# EAGLE board FPGA_board-v1 (EAGLE 9.5.2), part 1 of 2
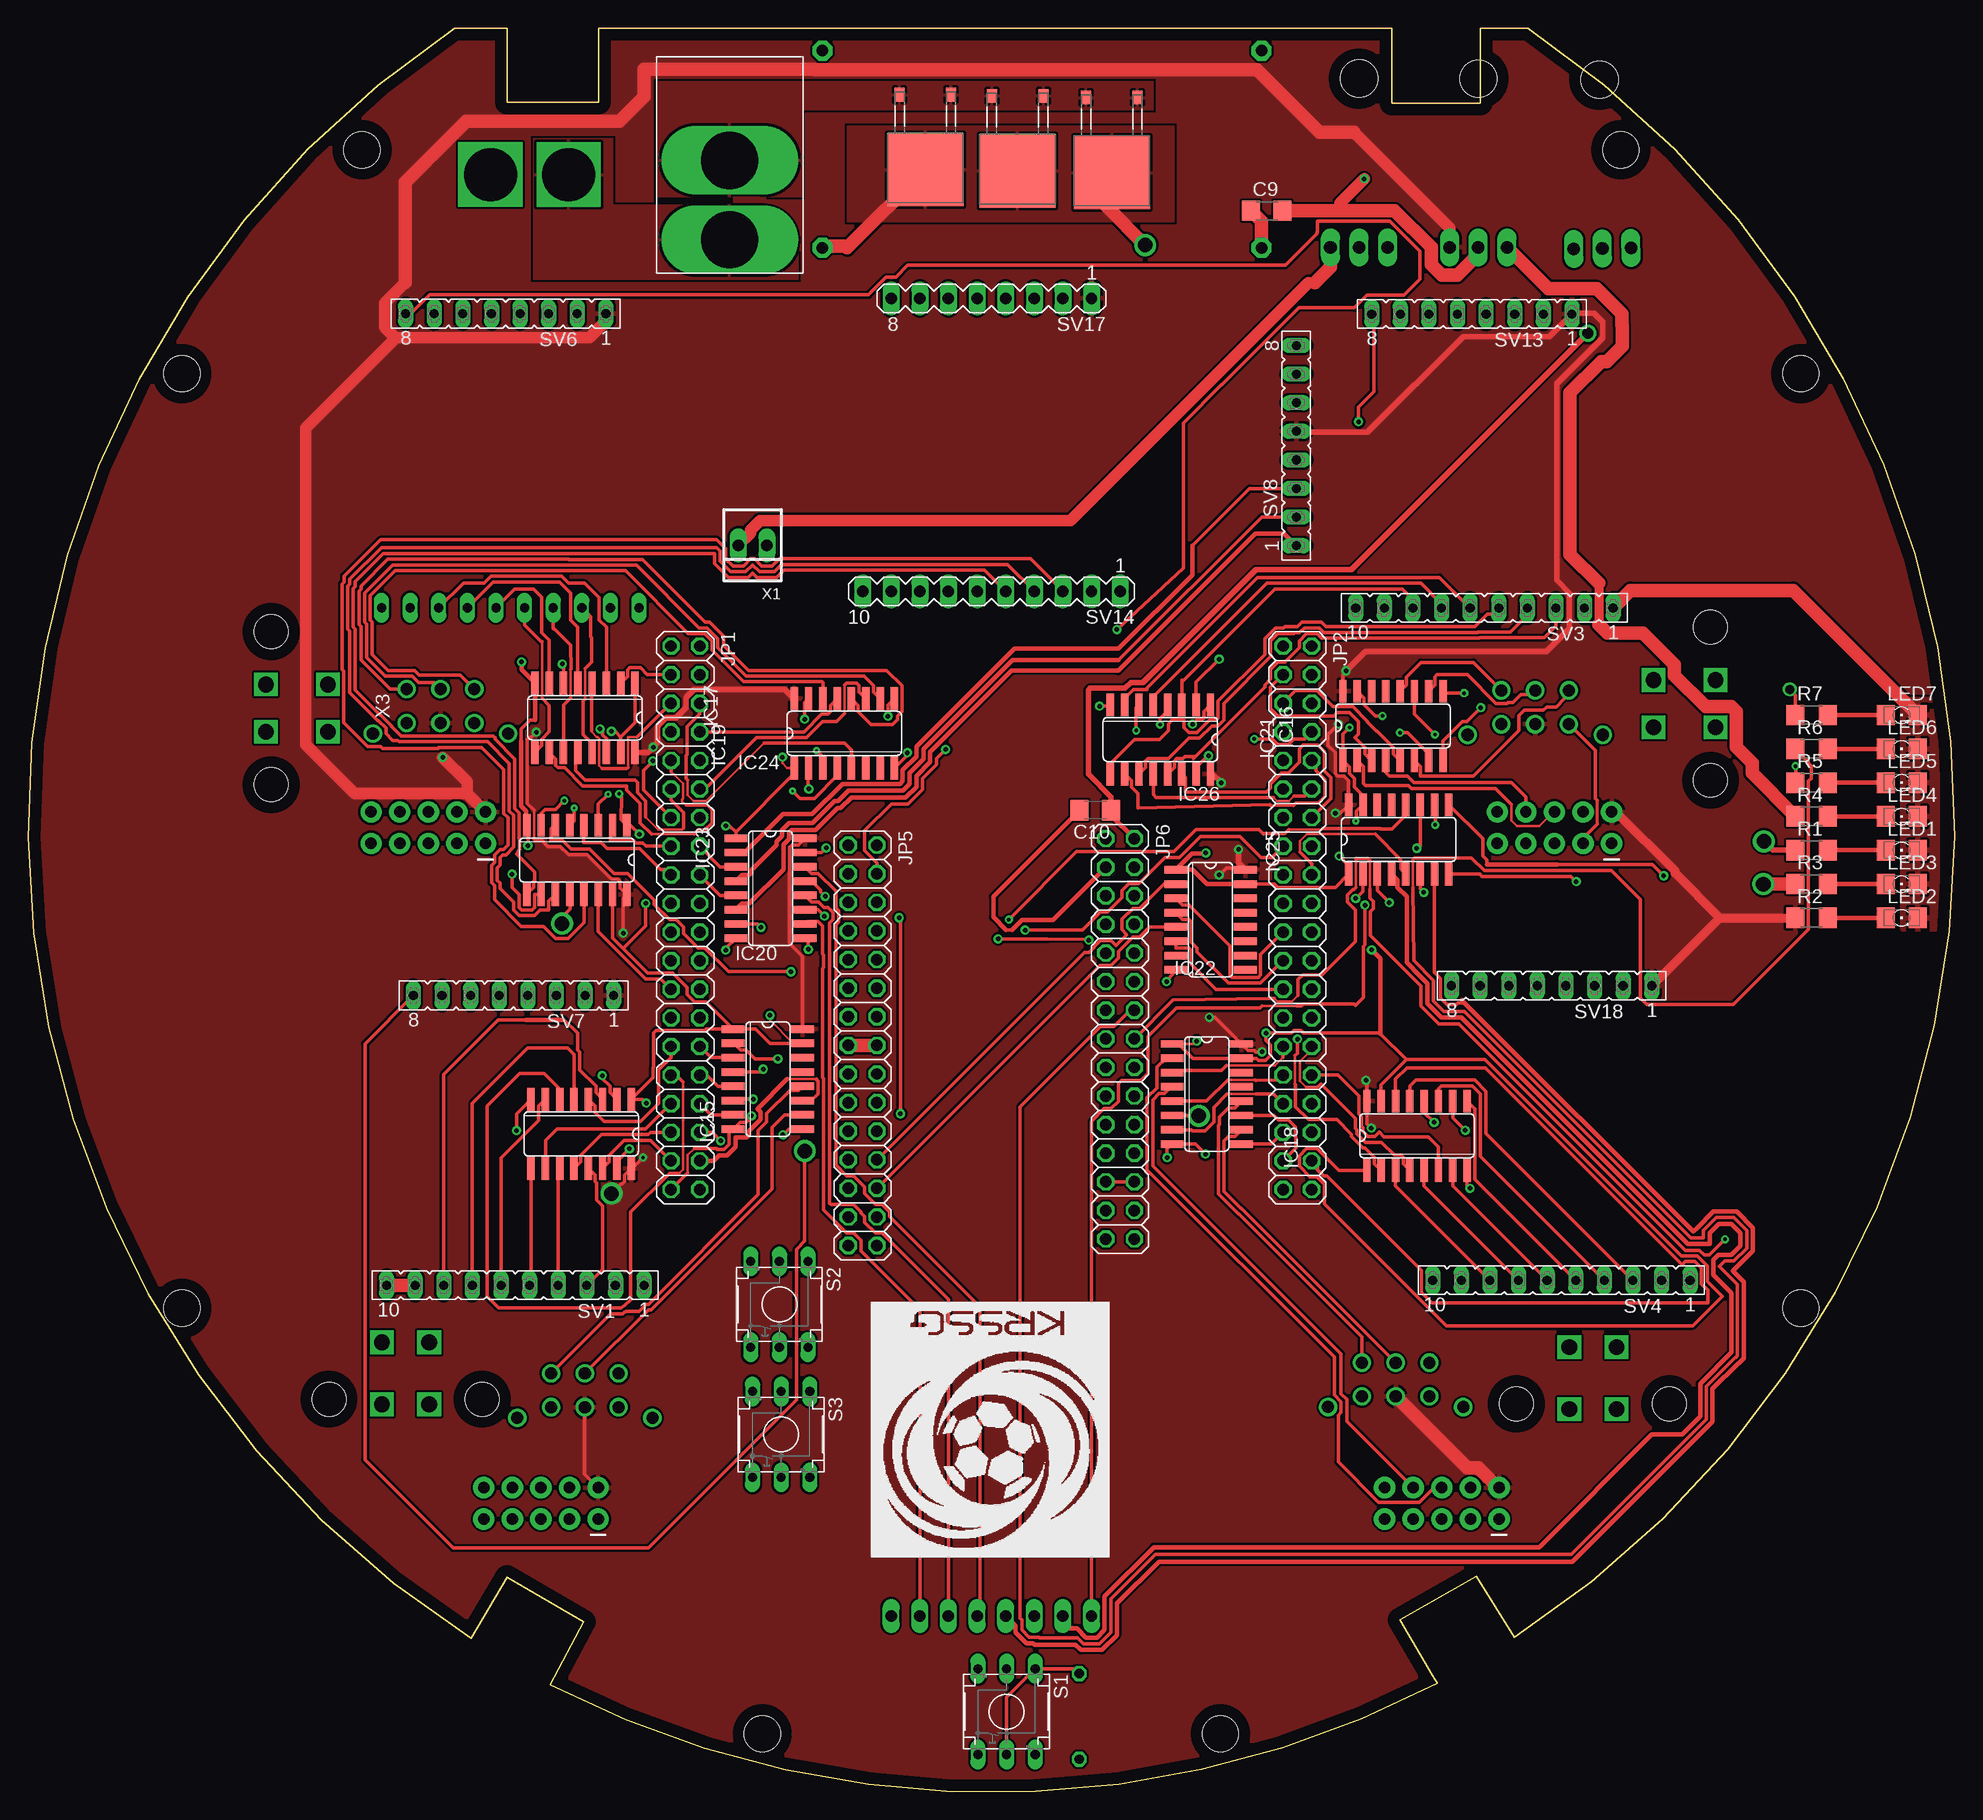
[diagram p1: board, top side]
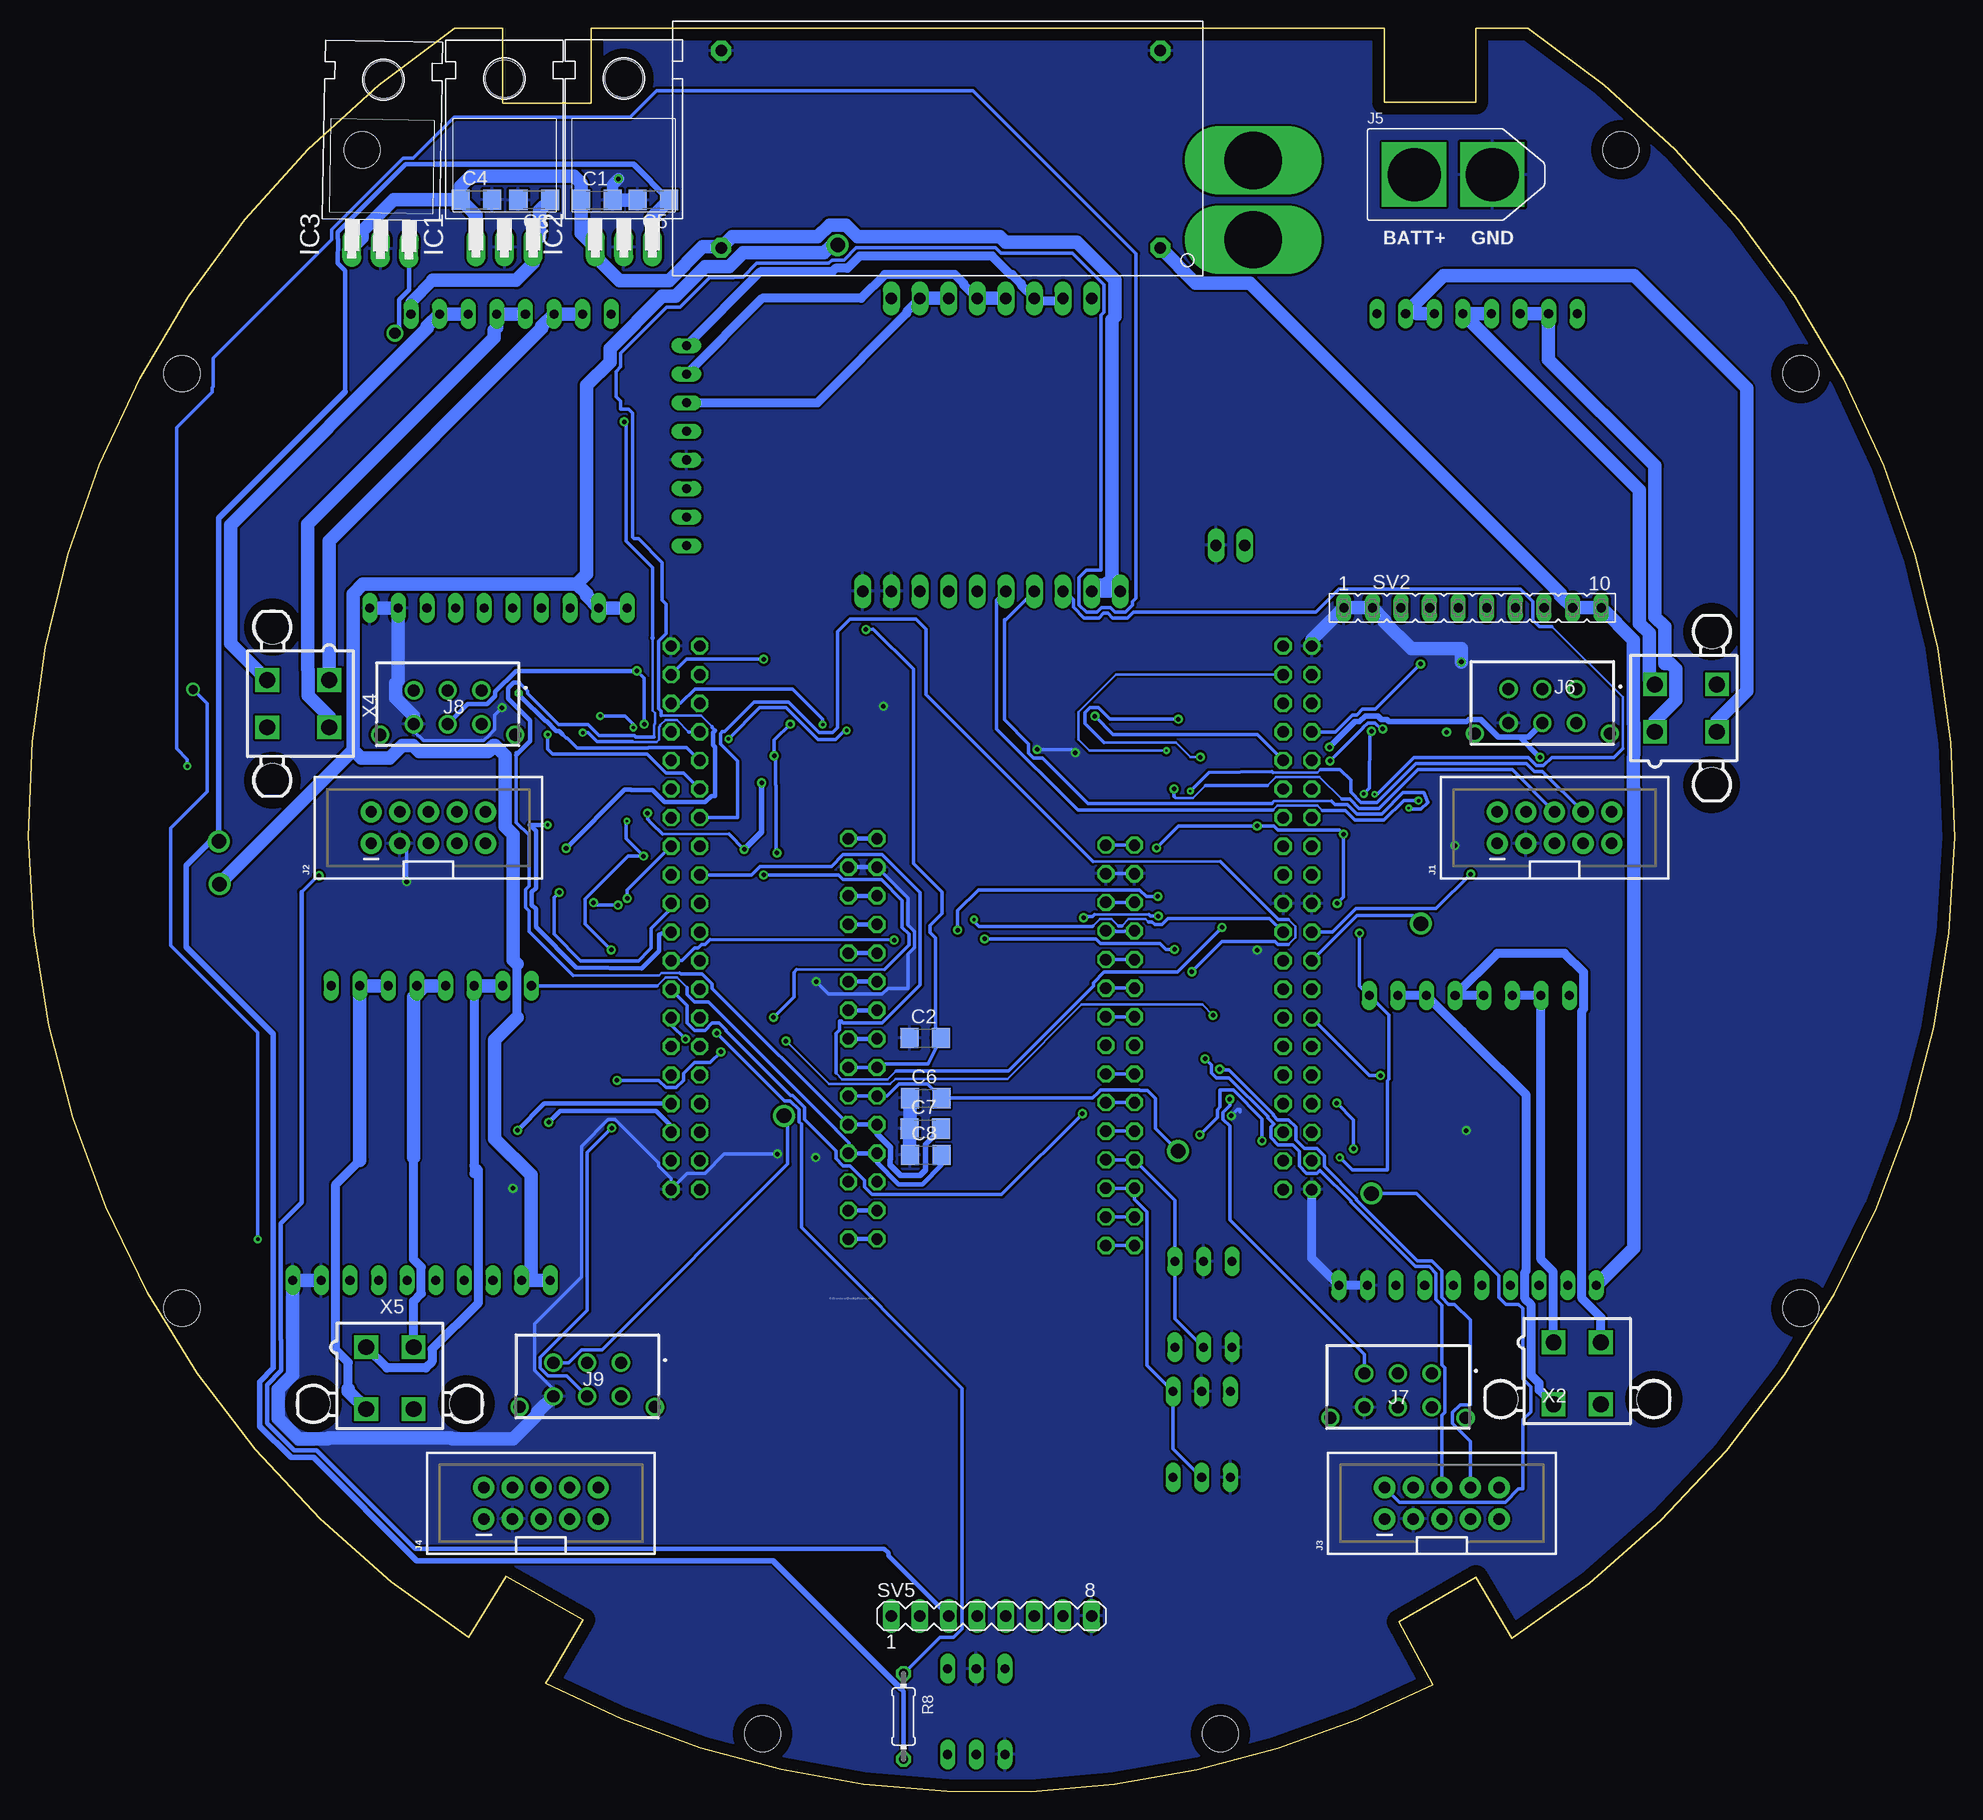
[diagram p2: board, bottom side, seen from below]

Size 171.07 x 156.59 mm. Coordinates in mm from the lower left corner, seen from the top.
Outline: 133.18,156.59 128.95,156.59
Outline: 121.08,156.59 50.64,156.59
Outline: 42.52,156.59 37.88,156.59
Outline: 37.88,156.59 42.52,156.59
Outline: 50.64,156.59 121.08,156.59
Outline: 128.95,156.59 133.18,156.59
Outline: 133.18,156.59 128.95,156.59
Outline: 121.08,156.59 50.64,156.59
Outline: 42.52,156.59 37.88,156.59
Outline: 42.52,156.59 42.52,150.03 50.64,150.03 50.64,156.59
Outline: 121.08,156.59 121.08,149.93 128.95,149.93 128.95,156.59
Outline: 133.18,156.59 arc-113 131.95,13.69 128.61,19.1 121.79,15.26 124.69,10.3 125.13,9.59 arc-55 46.33,9.49 49.33,15.07 42.51,19.04 39.33,13.59 arc-113 37.88,156.59
Copper layers (1*16): Top 0.035mm / dielectric 0.3mm / Bottom 0.035mm
Design rules "default *": minimum track width 6mil, minimum drill 0.35mm, track to track 6mil, track to pad 6mil, pad to pad 6mil, via to via 6mil, smd to smd 6mil, copper to edge 40mil, drill to drill 6mil, minimum pad ring 10mil, minimum via ring 8mil, stop-mask expansion 4mil, vias tented up to drill 0mil, thermal gap 10mil
Net classes: 0 signal1: width 0.3 mm, drill 0.4 mm, clearance 0.2 mm; 1 5v: width 0.4 mm, drill 0.4 mm, clearance 0.2 mm; 2 18V: width 1.2 mm, drill 1.3 mm, clearance 0.2 mm; 3 signal: width 0.3 mm, drill 0.4 mm, clearance 0.2 mm; 4 gnd: width 0.3 mm, drill 0.4 mm, clearance 0.2 mm; 5 VCKT: width 4 mm, drill 4 mm, clearance 0.2 mm; 6 motor: width 0.8 mm, drill 1 mm, clearance 0.2 mm
Holes 3.2 mm at 13.66,42.92 65.2,5.12 105.87,5.12 157.41,42.92 29.64,145.78 13.66,125.92 141.42,145.78 157.41,125.92

## Footprints (pad centres in the part's own frame; a part is rotated, then mirrored left to right if it is on the bottom)
C1206 = smd 1.6 x 1.8: 1 -1.4,0; 2 1.4,0
TO220H = drill 1.118 long: 1 -2.54,-10.16; 2 0,-10.16; 3 2.54,-10.16 | hole 3.302: 0,4.826
SO16 = smd 0.66 x 2.032: 1 -4.445,-3.073; 2 -3.175,-3.073; 3 -1.905,-3.073; 4 -0.635,-3.073; 5 0.635,-3.073; 6 1.905,-3.073; 7 3.175,-3.073; 8 4.445,-3.073; 9 4.445,3.073; 10 3.175,3.073; 11 1.905,3.073; 12 0.635,3.073; 13 -0.635,3.073; 14 -1.905,3.073; 15 -3.175,3.073; 16 -4.445,3.073
2X5-SHROUDED_LOCK = drill 1.016 pad 1.88: 1 -1.397,5.08; 2 1.397,5.08; 3 -1.397,2.54; 4 1.397,2.54; 5 -1.397,0; 6 1.397,0; 7 -1.397,-2.54; 8 1.397,-2.54; 9 -1.397,-5.08; 10 1.397,-5.08
XT-60 = drill 4.7 square: BATT 0,4.154; GND 0,11.092
43045-0613 = drill 1.07 pad 1.62: 1 3,0; 2 0,0; 3 -3,0; 4 3,3; 5 0,3; 6 -3,3; 7 -6,3.94; 8 6,3.94
2X20 = drill 1.016 octagon: 1 -24.13,-1.27; 2 -24.13,1.27; 3 -21.59,-1.27; 4 -21.59,1.27; 5 -19.05,-1.27; 6 -19.05,1.27; 7 -16.51,-1.27; 8 -16.51,1.27; 9 -13.97,-1.27; 10 -13.97,1.27; 11 -11.43,-1.27; 12 -11.43,1.27; 13 -8.89,-1.27; 14 -8.89,1.27; 15 -6.35,-1.27; 16 -6.35,1.27; 17 -3.81,-1.27; 18 -3.81,1.27; 19 -1.27,-1.27; 20 -1.27,1.27; 21 1.27,-1.27; 22 1.27,1.27; 23 3.81,-1.27; 24 3.81,1.27; 25 6.35,-1.27; 26 6.35,1.27; 27 8.89,-1.27; 28 8.89,1.27; 29 11.43,-1.27; 30 11.43,1.27; 31 13.97,-1.27; 32 13.97,1.27; 33 16.51,-1.27; 34 16.51,1.27; 35 19.05,-1.27; 36 19.05,1.27; 37 21.59,-1.27; 38 21.59,1.27; 39 24.13,-1.27; 40 24.13,1.27
2X15 = drill 1.016 octagon: 1 -17.78,-1.27; 2 -17.78,1.27; 3 -15.24,-1.27; 4 -15.24,1.27; 5 -12.7,-1.27; 6 -12.7,1.27; 7 -10.16,-1.27; 8 -10.16,1.27; 9 -7.62,-1.27; 10 -7.62,1.27; 11 -5.08,-1.27; 12 -5.08,1.27; 13 -2.54,-1.27; 14 -2.54,1.27; 15 0,-1.27; 16 0,1.27; 17 2.54,-1.27; 18 2.54,1.27; 19 5.08,-1.27; 20 5.08,1.27; 21 7.62,-1.27; 22 7.62,1.27; 23 10.16,-1.27; 24 10.16,1.27; 25 12.7,-1.27; 26 12.7,1.27; 27 15.24,-1.27; 28 15.24,1.27; 29 17.78,-1.27; 30 17.78,1.27
1206 = smd 1.6 x 1.803: A -1.422,0; C 1.422,0
R1206 = smd 1.6 x 1.803: 1 -1.422,0; 2 1.422,0
0204/7 = drill 0.813 octagon: 1 -3.81,0; 2 3.81,0
TME1 = drill 0.813 long: 1 -2.54,-3.81; 2 0,-3.81; 3 2.54,-3.81; 4 2.54,3.81; 5 0,3.81; 6 -2.54,3.81
FE10 = drill 0.813 long: 1 -11.43,0; 2 -8.89,0; 3 -6.35,0; 4 -3.81,0; 5 -1.27,0; 6 1.27,0; 7 3.81,0; 8 6.35,0; 9 8.89,0; 10 11.43,0
MA08-1 = drill 1.016 long: 1 -8.89,0; 2 -6.35,0; 3 -3.81,0; 4 -1.27,0; 5 1.27,0; 6 3.81,0; 7 6.35,0; 8 8.89,0
FE08 = drill 0.813 long: 1 -8.89,0; 2 -6.35,0; 3 -3.81,0; 4 -1.27,0; 5 1.27,0; 6 3.81,0; 7 6.35,0; 8 8.89,0
MA10-1 = drill 1.016 long: 1 -11.43,0; 2 -8.89,0; 3 -6.35,0; 4 -3.81,0; 5 -1.27,0; 6 1.27,0; 7 3.81,0; 8 6.35,0; 9 8.89,0; 10 11.43,0
TO228P1042X238-3N = smd 0.889 x 1.219: 1 -2.286,-6.502; 3 2.286,-6.502 | smd 6.731 x 6.502: 2 0,0.152
BUCK = drill 1.016 pad 1.778 octagon: GND 0,0; GNDO 39,0; VIN 0,17.5; VOUT 39,17.5
DA10 = drill 5.08 pad 5.334 long: P$1 0,0; P$2 -7.048,0
22-23-2021 = drill 1 long: 1 -1.27,0; 2 1.27,0
5566-4 = drill 1.4 square: 1 2.1,-2.75; 2 -2.1,-2.75; 3 2.1,2.75; 4 -2.1,2.75 | hole 3: 6.8,2.29; -6.8,2.29

## Placement (x,y rotation side)
C1  47uF  [C1206]  120.58,141.33 0 bottom
C2  47uF  [C1206]  91.41,66.92 0 bottom
C3  47uF  [C1206]  126.14,141.33 180 bottom
C4  47uF  [C1206]  131.26,141.36 0 bottom
C5  47uF  [C1206]  115.56,141.33 180 bottom
C6  47uF  [C1206]  91.37,61.58 0 bottom
C7  47uF  [C1206]  91.4,58.87 0 bottom
C8  47uF  [C1206]  91.37,56.53 0 bottom
C9  47uF  [C1206]  109.99,140.38 0 top
C10  47uF  [C1206]  94.77,87.13 180 top
IC1  7805T  [TO220H]  128.77,147.28 0 bottom
IC2  7805T  [TO220H]  118.18,147.29 0 bottom
IC3  7805T  [TO220H]  139.61,147.18 359 bottom
IC15  74LS365D  [SO16]  49.1,58.4 180 top
IC16  74LS365D  [SO16]  100.54,93.43 180 top
IC17  74LS365D  [SO16]  49.44,95.35 180 top
IC18  74LS365D  [SO16]  123.32,58.23 0 top
IC19  74LS365D  [SO16]  72.47,93.97 0 top
IC20  74LS365D  [SO16]  65.68,63.26 270 top
IC21  74LS365D  [SO16]  121.19,94.63 0 top
IC22  74LS365D  [SO16]  104.66,61.94 270 top
IC23  74LS365D  [SO16]  48.72,82.73 180 top
IC24  74LS365D  [SO16]  65.91,80.21 270 top
IC25  74LS365D  [SO16]  121.7,84.55 0 top
IC26  74LS365D  [SO16]  105,77.41 270 top
J1  [2X5-SHROUDED_LOCK]  35.53,85.59 90 bottom
J2  [2X5-SHROUDED_LOCK]  135.53,85.59 90 bottom
J3  [2X5-SHROUDED_LOCK]  45.53,25.59 90 bottom
J4  [2X5-SHROUDED_LOCK]  125.53,25.59 90 bottom
J5  XT-60BATT_LABEL  [XT-60]  52.14,143.59 270 bottom
J6  43045-0613  [43045-0613]  36.61,97.89 180 bottom
J7  43045-0613  [43045-0613]  49.43,37.13 180 bottom
J8  43045-0613  [43045-0613]  133.82,97.78 180 bottom
J9  43045-0613  [43045-0613]  121.43,38.08 180 bottom
JP1  [2X20]  58.36,77.59 270 top
JP2  [2X20]  112.71,77.59 270 top
JP5  [2X15]  74.1,66.26 270 top
JP6  [2X15]  96.96,66.84 270 top
LED1  [1206]  166.36,83.59 0 top
LED2  [1206]  166.36,77.59 0 top
LED3  [1206]  166.36,80.59 0 top
LED4  [1206]  166.36,86.59 0 top
LED5  [1206]  166.36,89.59 0 top
LED6  [1206]  166.36,92.59 0 top
LED7  [1206]  166.36,95.59 0 top
R1  [R1206]  158.36,83.59 0 top
R2  [R1206]  158.36,77.59 0 top
R3  [R1206]  158.36,80.59 0 top
R4  [R1206]  158.36,86.59 0 top
R5  [R1206]  158.36,89.59 0 top
R6  [R1206]  158.36,92.59 0 top
R7  [R1206]  158.36,95.59 0 top
R8  10k  [0204/7]  93.33,6.66 270 bottom
S1  TME1  [TME1]  86.88,7.1 180 top
S2  TME1  [TME1]  66.7,43.26 180 top
S3  TME1  [TME1]  66.86,31.71 180 top
SV1  [FE10]  43.25,44.95 180 top
SV2  [FE10]  42.81,105.12 0 bottom
SV3  [FE10]  129.31,105.1 180 top
SV4  [FE10]  136.15,45.4 180 top
SV5  [MA08-1]  85.53,15.59 0 bottom
SV6  [FE08]  42.4,131.24 180 top
SV7  [FE08]  43.09,70.69 180 top
SV8  [FE08]  112.61,119.52 90 top
SV13  [FE08]  128.19,131.2 180 top
SV14  [MA10-1]  85.53,106.59 180 top
SV17  [MA08-1]  85.53,132.59 180 top
SV18  [FE08]  135.28,71.55 180 top
U1  [TO228P1042X238-3N]  96.23,143.92 180 top
U2  [TO228P1042X238-3N]  87.85,144.07 180 top
U3  [TO228P1042X238-3N]  79.67,144.18 180 top
U$1  [LOGO3]  96,43.46 180 top
U$4  BUCK  [BUCK]  70.53,154.59 180 bottom
U$5  [DA10]  62.29,144.85 90 top
X1  22-23-2021  [22-23-2021]  64.32,110.67 180 top
X2  5566-4  [5566-4]  33.51,37.13 180 bottom
X3  5566-4  [5566-4]  23.86,96.21 270 bottom
X4  5566-4  [5566-4]  147.09,96.6 90 bottom
X5  5566-4  [5566-4]  138.95,36.71 180 bottom